# EAGLE design pcb9_21 (EAGLE 9.6.2)
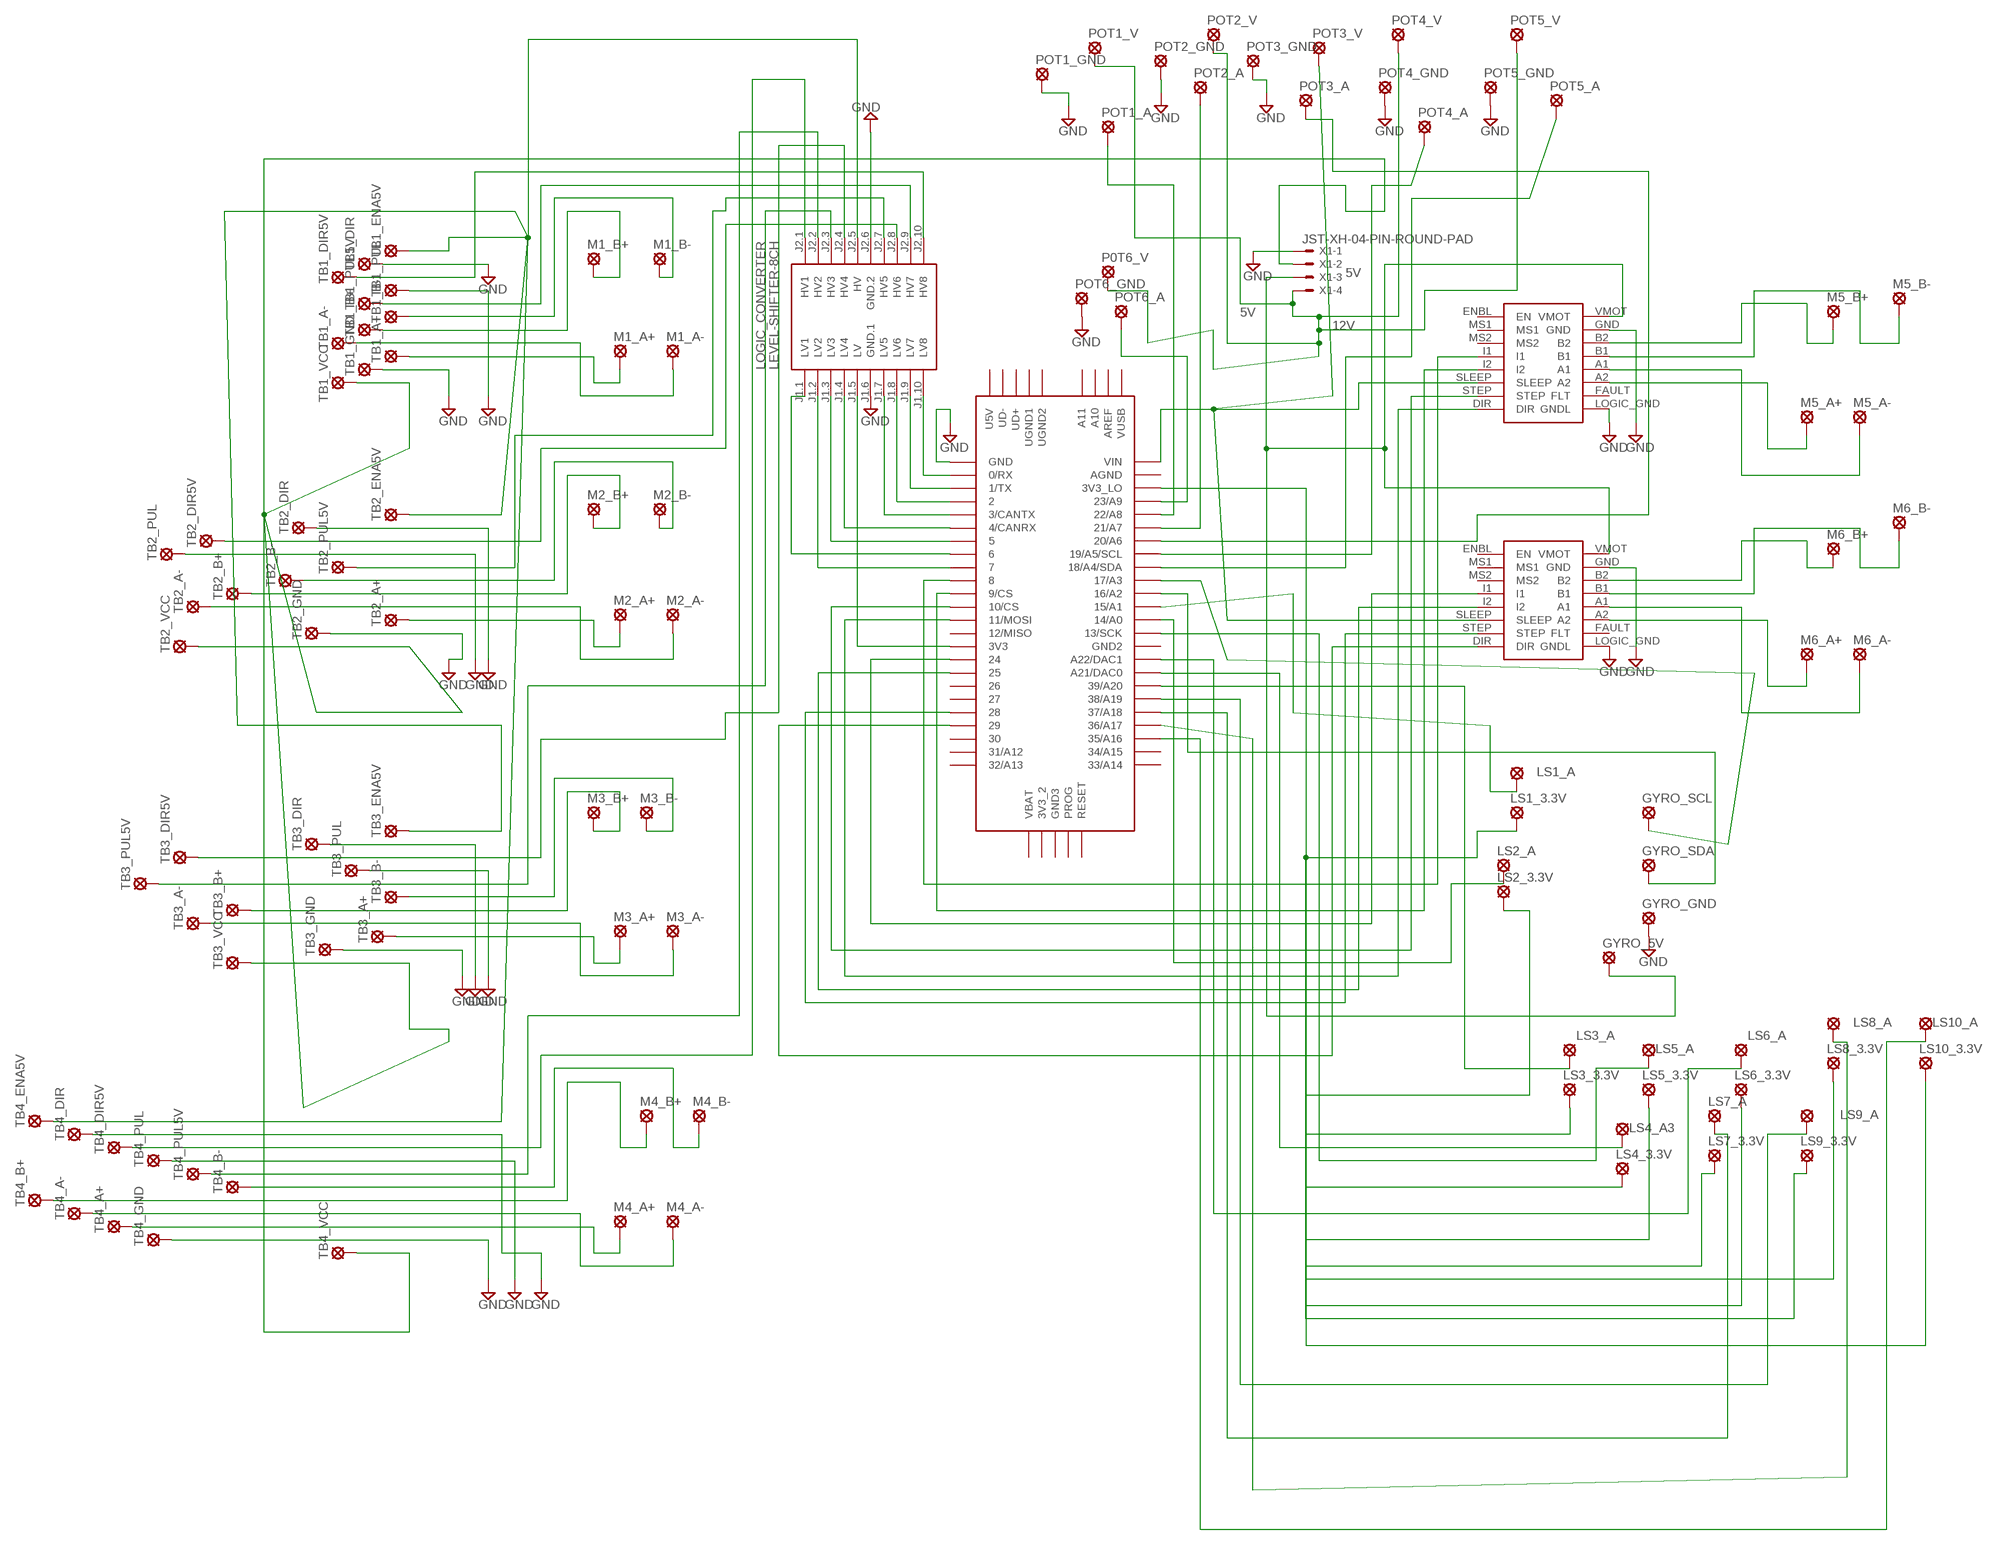
[diagram p0: schematic, sheet 1]

## Parts
GYRO_5V  LSP11  [LSP11]
GYRO_GND  LSP11  [LSP11]
GYRO_SCL  LSP11  [LSP11]
GYRO_SDA  LSP11  [LSP11]
LOGIC_CONVERTER  LEVEL-SHIFTER-8CH  [LEVEL-SHIFTER-8CH]
LS1_3.3V  LSP11  [LSP11]
LS1_A  LSP11  [LSP11]
LS2_3.3V  LSP11  [LSP11]
LS2_A  LSP11  [LSP11]
LS3_3.3V  LSP11  [LSP11]
LS3_A  LSP11  [LSP11]
LS4_3.3V  LSP11  [LSP11]
LS4_A3  LSP11  [LSP11]
LS5_3.3V  LSP11  [LSP11]
LS5_A  LSP11  [LSP11]
LS6_3.3V  LSP11  [LSP11]
LS6_A  LSP11  [LSP11]
LS7_3.3V  LSP11  [LSP11]
LS7_A  LSP11  [LSP11]
LS8_3.3V  LSP11  [LSP11]
LS8_A  LSP11  [LSP11]
LS9_3.3V  LSP11  [LSP11]
LS9_A  LSP11  [LSP11]
LS10_3.3V  LSP11  [LSP11]
LS10_A  LSP11  [LSP11]
M1_A+  LSP11  [LSP11]
M1_A-  LSP11  [LSP11]
M1_B+  LSP11  [LSP11]
M1_B-  LSP11  [LSP11]
M2_A+  LSP11  [LSP11]
M2_A-  LSP11  [LSP11]
M2_B+  LSP11  [LSP11]
M2_B-  LSP11  [LSP11]
M3_A+  LSP11  [LSP11]
M3_A-  LSP11  [LSP11]
M3_B+  LSP11  [LSP11]
M3_B-  LSP11  [LSP11]
M4_A+  LSP11  [LSP11]
M4_A-  LSP11  [LSP11]
M4_B+  LSP11  [LSP11]
M4_B-  LSP11  [LSP11]
M5_A+  LSP11  [LSP11]
M5_A-  LSP11  [LSP11]
M5_B+  LSP11  [LSP11]
M5_B-  LSP11  [LSP11]
M6_A+  LSP11  [LSP11]
M6_A-  LSP11  [LSP11]
M6_B+  LSP11  [LSP11]
M6_B-  LSP11  [LSP11]
MP6500_1  MP6500THROUGH_HOLE  [MP6500]
MP6500_2  MP6500THROUGH_HOLE  [MP6500]
P0T6_V  LSP11  [LSP11]
POT1_A  LSP11  [LSP11]
POT1_GND  LSP11  [LSP11]
POT1_V  LSP11  [LSP11]
POT2_A  LSP11  [LSP11]
POT2_GND  LSP11  [LSP11]
POT2_V  LSP11  [LSP11]
POT3_A  LSP11  [LSP11]
POT3_GND  LSP11  [LSP11]
POT3_V  LSP11  [LSP11]
POT4_A  LSP11  [LSP11]
POT4_GND  LSP11  [LSP11]
POT4_V  LSP11  [LSP11]
POT5_A  LSP11  [LSP11]
POT5_GND  LSP11  [LSP11]
POT5_V  LSP11  [LSP11]
POT6_A  LSP11  [LSP11]
POT6_GND  LSP11  [LSP11]
TB1_A+  LSP11  [LSP11]
TB1_A-  LSP11  [LSP11]
TB1_B+  LSP11  [LSP11]
TB1_B-  LSP11  [LSP11]
TB1_DIR  LSP11  [LSP11]
TB1_DIR5V  LSP11  [LSP11]
TB1_ENA5V  LSP11  [LSP11]
TB1_GND  LSP11  [LSP11]
TB1_PUL  LSP11  [LSP11]
TB1_PUL5V  LSP11  [LSP11]
TB1_VCC  LSP11  [LSP11]
TB2_A+  LSP11  [LSP11]
TB2_A-  LSP11  [LSP11]
TB2_B+  LSP11  [LSP11]
TB2_B-  LSP11  [LSP11]
TB2_DIR  LSP11  [LSP11]
TB2_DIR5V  LSP11  [LSP11]
TB2_ENA5V  LSP11  [LSP11]
TB2_GND  LSP11  [LSP11]
TB2_PUL  LSP11  [LSP11]
TB2_PUL5V  LSP11  [LSP11]
TB2_VCC  LSP11  [LSP11]
TB3_A+  LSP11  [LSP11]
TB3_A-  LSP11  [LSP11]
TB3_B+  LSP11  [LSP11]
TB3_B-  LSP11  [LSP11]
TB3_DIR  LSP11  [LSP11]
TB3_DIR5V  LSP11  [LSP11]
TB3_ENA5V  LSP11  [LSP11]
TB3_GND  LSP11  [LSP11]
TB3_PUL  LSP11  [LSP11]
TB3_PUL5V  LSP11  [LSP11]
TB3_VCC  LSP11  [LSP11]
TB4_A+  LSP11  [LSP11]
TB4_A-  LSP11  [LSP11]
TB4_B+  LSP11  [LSP11]
TB4_B-  LSP11  [LSP11]
TB4_DIR  LSP11  [LSP11]
TB4_DIR5V  LSP11  [LSP11]
TB4_ENA5V  LSP11  [LSP11]
TB4_GND  LSP11  [LSP11]
TB4_PUL  LSP11  [LSP11]
TB4_PUL5V  LSP11  [LSP11]
TB4_VCC  LSP11  [LSP11]
TEENSY4.1  TEENSY_3.5/3.6  [TEENSY_3.5/3.6]
X1  JST-XH-04-PIN-ROUND-PAD  [JST-XH-04-PACKAGE-ROUND-PAD]

## Nets
5V: GYRO_5V.MP MP6500_1.VMOT MP6500_2.VMOT TB1_VCC.MP TB2_VCC.MP TB3_VCC.MP TB4_VCC.MP X1.2 X1.3
12V: P0T6_V.MP POT1_V.MP POT2_V.MP POT4_V.MP POT5_V.MP X1.4
GND: GYRO_GND.MP LOGIC_CONVERTER.J1.6(GND.1) LOGIC_CONVERTER.J2.6(GND.2) MP6500_1.GND MP6500_1.LOGIC_GND(GNDL) MP6500_2.GND MP6500_2.LOGIC_GND(GNDL) POT1_GND.MP POT2_GND.MP POT3_GND.MP POT4_GND.MP POT5_GND.MP POT6_GND.MP TB1_DIR.MP TB1_GND.MP TB1_PUL.MP TB2_DIR.MP TB2_GND.MP TB2_PUL.MP TB3_DIR.MP TB3_GND.MP TB3_PUL.MP TB4_DIR.MP TB4_GND.MP TB4_PUL.MP TEENSY4.1.GND X1.1
N$1: M1_A+.MP TB1_A+.MP
N$2: M1_A-.MP TB1_A-.MP
N$3: M1_B+.MP TB1_B+.MP
N$4: M1_B-.MP TB1_B-.MP
N$5: M2_A+.MP TB2_A+.MP
N$6: M2_A-.MP TB2_A-.MP
N$7: M2_B+.MP TB2_B+.MP
N$8: M2_B-.MP TB2_B-.MP
N$9: M3_A+.MP TB3_A+.MP
N$10: M3_A-.MP TB3_A-.MP
N$11: M3_B+.MP TB3_B+.MP
N$12: M3_B-.MP TB3_B-.MP
N$13: M4_A+.MP TB4_A+.MP
N$14: M4_A-.MP TB4_A-.MP
N$15: M4_B+.MP TB4_B+.MP
N$16: M4_B-.MP TB4_B-.MP
N$17: LOGIC_CONVERTER.J2.9(HV7) TB1_PUL5V.MP
N$18: LOGIC_CONVERTER.J2.8(HV6) TB2_DIR5V.MP
N$19: LOGIC_CONVERTER.J1.7(LV5) TEENSY4.1.3/CANTX
N$20: LOGIC_CONVERTER.J2.10(HV8) TB1_DIR5V.MP
N$21: LOGIC_CONVERTER.J2.4(HV4) TB3_DIR5V.MP
N$22: LOGIC_CONVERTER.J1.4(LV4) TEENSY4.1.4/CANRX
N$23: LOGIC_CONVERTER.J1.1(LV1) TEENSY4.1.6
N$24: LOGIC_CONVERTER.J1.2(LV2) TEENSY4.1.7
N$25: M5_A+.MP MP6500_1.A2
N$26: M5_A-.MP MP6500_1.A1
N$27: POT6_A.MP TEENSY4.1.23/A9
N$28: M5_B-.MP MP6500_1.B1
N$29: M5_B+.MP MP6500_1.B2
N$30: M6_A+.MP MP6500_2.A2
N$31: M6_A-.MP MP6500_2.A1
N$32: M6_B-.MP MP6500_2.B1
N$33: M6_B+.MP MP6500_2.B2
N$34: MP6500_1.I1 TEENSY4.1.8
N$35: MP6500_1.I2 TEENSY4.1.9/CS
N$36: MP6500_1.STEP TEENSY4.1.10/CS
N$37: MP6500_1.DIR TEENSY4.1.11/MOSI
N$38: MP6500_2.I1 TEENSY4.1.24
N$39: MP6500_2.I2 TEENSY4.1.25
N$40: MP6500_2.STEP TEENSY4.1.28
N$41: MP6500_2.DIR TEENSY4.1.29
N$42: POT1_A.MP TEENSY4.1.22/A8
N$43: LOGIC_CONVERTER.J1.9(LV7) TEENSY4.1.1/TX
N$44: LOGIC_CONVERTER.J1.10(LV8) TEENSY4.1.0/RX
N$45: LOGIC_CONVERTER.J1.8(LV6) TEENSY4.1.2
N$46: LOGIC_CONVERTER.J2.3(HV3) TB3_PUL5V.MP
N$47: LOGIC_CONVERTER.J2.7(HV5) TB2_PUL5V.MP
N$48: LOGIC_CONVERTER.J1.3(LV3) TEENSY4.1.5
N$49: LOGIC_CONVERTER.J2.2(HV2) TB4_PUL5V.MP
N$50: LS5_A.MP TEENSY4.1.13/SCK
N$51: LOGIC_CONVERTER.J1.5(LV) TEENSY4.1.3V3
N$52: LOGIC_CONVERTER.J2.1(HV1) TB4_DIR5V.MP
N$53: POT2_A.MP TEENSY4.1.21/A7
N$54: POT3_A.MP TEENSY4.1.20/A6
N$55: POT4_A.MP TEENSY4.1.19/A5/SCL
N$56: MP6500_1.SLEEP MP6500_2.SLEEP POT3_V.MP TEENSY4.1.VIN
N$57: GYRO_SCL.MP TEENSY4.1.17/A3
N$58: GYRO_SDA.MP TEENSY4.1.16/A2
N$59: LS1_A.MP TEENSY4.1.15/A1
N$60: LS1_3.3V.MP LS2_3.3V.MP LS3_3.3V.MP LS4_3.3V.MP LS5_3.3V.MP LS6_3.3V.MP LS7_3.3V.MP LS8_3.3V.MP LS9_3.3V.MP LS10_3.3V.MP TEENSY4.1.3V3_LO
N$61: POT5_A.MP TEENSY4.1.18/A4/SDA
N$62: LOGIC_CONVERTER.J2.5(HV) TB1_ENA5V.MP TB2_ENA5V.MP TB3_ENA5V.MP TB4_ENA5V.MP
N$64: LS2_A.MP TEENSY4.1.14/A0
N$65: LS3_A.MP TEENSY4.1.39/A20
N$66: LS6_A.MP TEENSY4.1.A22/DAC1
N$67: LS4_A3.MP TEENSY4.1.21/DAC0(A21/DAC0)
N$68: LS9_A.MP TEENSY4.1.38/A19
N$69: LS7_A.MP TEENSY4.1.37/A18
N$70: LS8_A.MP TEENSY4.1.36/A17
N$71: LS10_A.MP TEENSY4.1.35/A16
Unconnected: MP6500_1.ENBL(EN) MP6500_1.FAULT(FLT) MP6500_1.MS1 MP6500_1.MS2 MP6500_2.ENBL(EN) MP6500_2.FAULT(FLT) MP6500_2.MS1 MP6500_2.MS2 TEENSY4.1.3V3_2 TEENSY4.1.12/MISO TEENSY4.1.26 TEENSY4.1.27 TEENSY4.1.30 TEENSY4.1.31/A12 TEENSY4.1.32/A13 TEENSY4.1.33/A14 TEENSY4.1.34/A15 TEENSY4.1.A10 TEENSY4.1.A11 TEENSY4.1.AGND TEENSY4.1.AREF TEENSY4.1.GND2 TEENSY4.1.GND3 TEENSY4.1.PROG TEENSY4.1.RESET TEENSY4.1.U5V TEENSY4.1.UD+ TEENSY4.1.UD- TEENSY4.1.UGND1 TEENSY4.1.UGND2 TEENSY4.1.VBAT TEENSY4.1.VUSB

## Library data of the parts
GYRO_5V GYRO_GND GYRO_SCL GYRO_SDA LS1_3.3V LS1_A LS2_3.3V LS2_A LS3_3.3V LS3_A LS4_3.3V LS4_A3 LS5_3.3V LS5_A LS6_3.3V LS6_A LS7_3.3V LS7_A LS8_3.3V LS8_A LS9_3.3V LS9_A LS10_3.3V LS10_A M1_A+ M1_A- M1_B+ M1_B- M2_A+ M2_A- M2_B+ M2_B- M3_A+ M3_A- M3_B+ M3_B- M4_A+ M4_A- M4_B+ M4_B- M5_A+ M5_A- M5_B+ M5_B- M6_A+ M6_A- M6_B+ M6_B- P0T6_V POT1_A POT1_GND POT1_V POT2_A POT2_GND POT2_V POT3_A POT3_GND POT3_V POT4_A POT4_GND POT4_V POT5_A POT5_GND POT5_V POT6_A POT6_GND TB1_A+ TB1_A- TB1_B+ TB1_B- TB1_DIR TB1_DIR5V TB1_ENA5V TB1_GND TB1_PUL TB1_PUL5V TB1_VCC TB2_A+ TB2_A- TB2_B+ TB2_B- TB2_DIR TB2_DIR5V TB2_ENA5V TB2_GND TB2_PUL TB2_PUL5V TB2_VCC TB3_A+ TB3_A- TB3_B+ TB3_B- TB3_DIR TB3_DIR5V TB3_ENA5V TB3_GND TB3_PUL TB3_PUL5V TB3_VCC TB4_A+ TB4_A- TB4_B+ TB4_B- TB4_DIR TB4_DIR5V TB4_ENA5V TB4_GND TB4_PUL TB4_PUL5V TB4_VCC = solpad:LSP11: SOLDER PAD drill 1.1 mm
LOGIC_CONVERTER = diy-modules:LEVEL-SHIFTER-8CH: 8-Channel Bi-Directional Logic Level Converter based on BSS128 transistors Click here to find device on ebay.com <http://www.ebay.com/sch/8+channel+level+converter> Note: There are many variants. Search for the proper version.
MP6500_1 MP6500_2 = MP6500:MP6500
TEENSY4.1 = Teensy356:TEENSY_3.5/3.6
X1 = Rembrandt Electronics - JST XH Connectors v1-0:JST-XH-04-PIN: JST XH Connector 2 Pin Wire to board connector. Pitch: 2,54 mm, (0.100") Number of pins: 4 Created by Rembrandt Electronics www.rembrandtelectronics.com

## Board
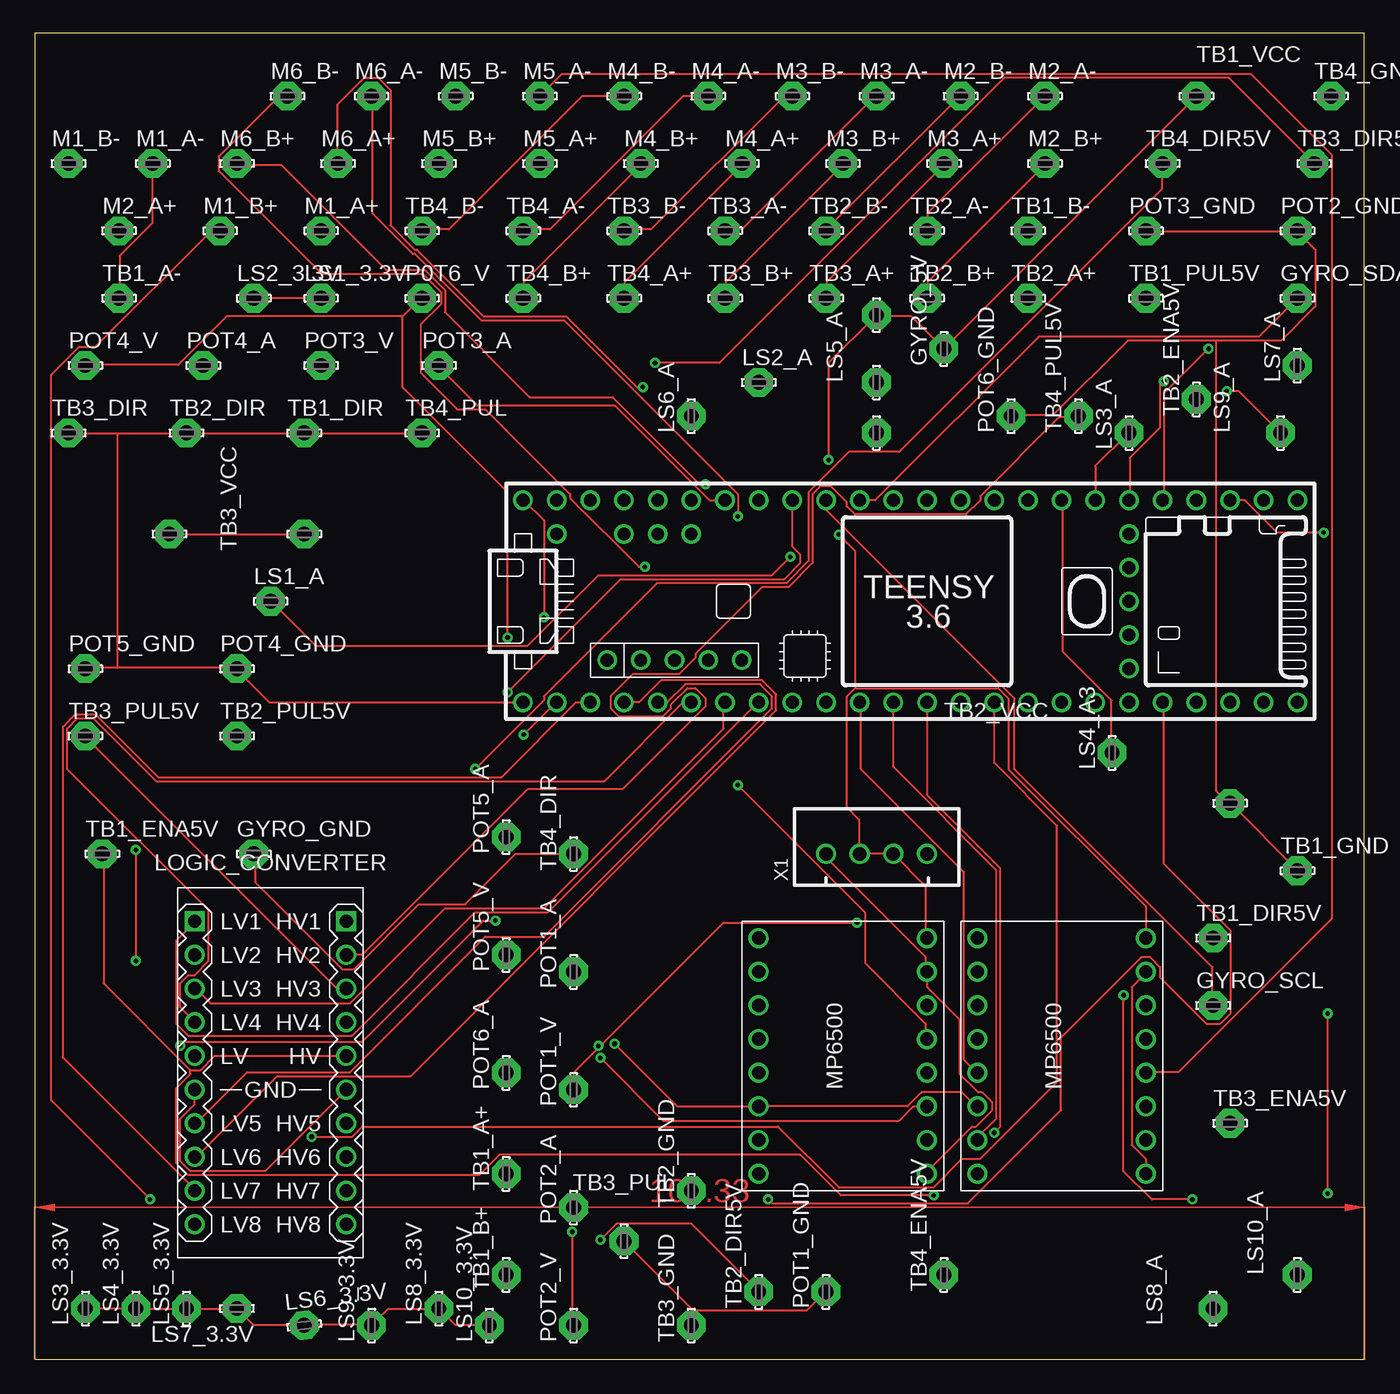
[diagram p1: board, top side]
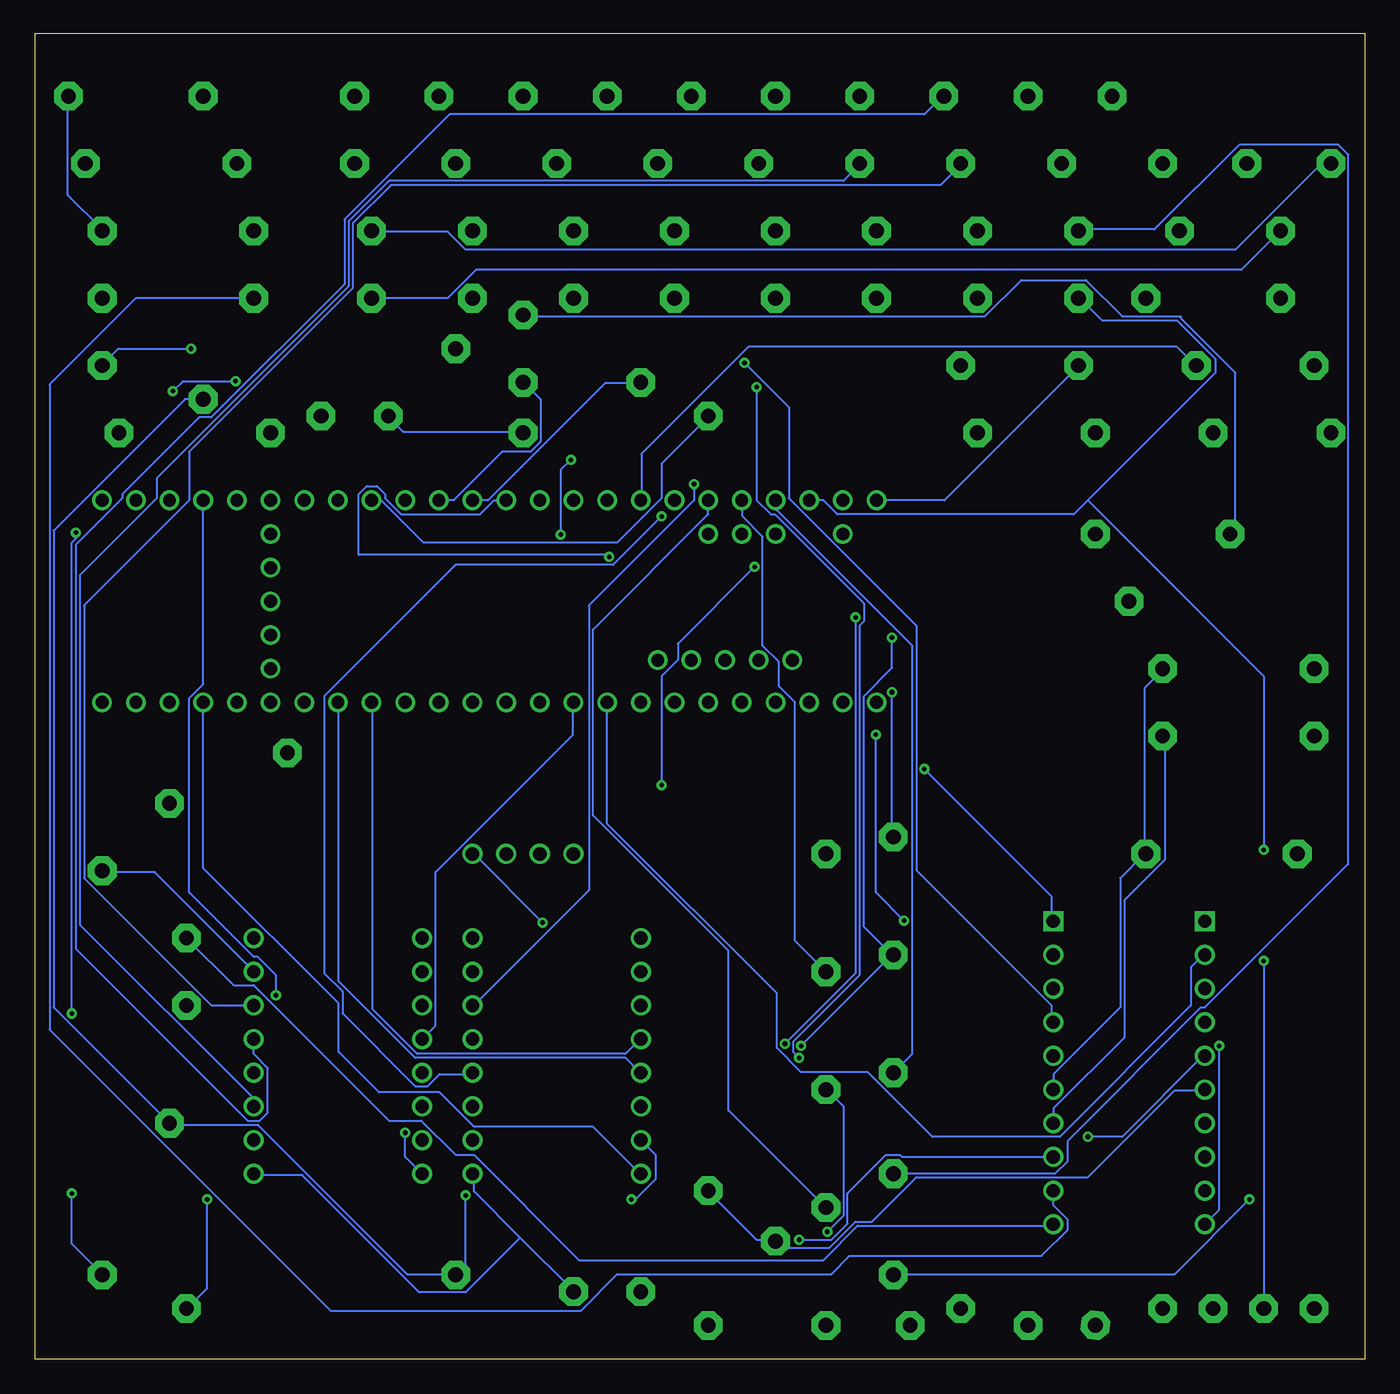
[diagram p2: board, bottom side, seen from below]

Size 100.31 x 100 mm. Coordinates in mm from the lower left corner, seen from the top.
Outline: 0,0 100.31,0 100.31,100 0,100 0,0
Copper layers (1*16): Top 0.035mm / dielectric 1.5mm / Bottom 0.035mm
Design rules "default": minimum track width 6mil, minimum drill 0.35mm, track to track 6mil, track to pad 6mil, pad to pad 6mil, via to via 6mil, smd to smd 6mil, copper to edge 40mil, drill to drill 6mil, minimum pad ring 10mil, minimum via ring 8mil, stop-mask expansion 4mil, vias tented up to drill 0mil, thermal gap 10mil

### Footprints (pad centres in the part's own frame; a part is rotated, then mirrored left to right if it is on the bottom)
LSP11 = drill 1.118 pad 2.159 octagon: MP 0,0
LEVEL-SHIFTER-8CH = drill 1 square: J1.1 -5.715,11.43; J2.1 5.715,11.43 | drill 1: J1.2 -5.715,8.89; J1.3 -5.715,6.35; J1.4 -5.715,3.81; J1.5 -5.715,1.27; J1.6 -5.715,-1.27; J1.7 -5.715,-3.81; J1.8 -5.715,-6.35; J1.9 -5.715,-8.89; J1.10 -5.715,-11.43; J2.2 5.715,8.89; J2.3 5.715,6.35; J2.4 5.715,3.81; J2.5 5.715,1.27; J2.6 5.715,-1.27; J2.7 5.715,-3.81; J2.8 5.715,-6.35; J2.9 5.715,-8.89; J2.10 5.715,-11.43
MP6500 = drill 1: A1 13.97,8.89; A2 13.97,6.35; B1 13.97,11.43; B2 13.97,13.97; DIR 1.27,1.27; ENBL 1.27,19.05; FAULT 13.97,3.81; GND 13.97,16.51; I1 1.27,11.43; I2 1.27,8.89; LOGIC_GND 13.97,1.27; MS1 1.27,16.51; MS2 1.27,13.97; SLEEP 1.27,6.35; STEP 1.27,3.81; VMOT 13.97,19.05
TEENSY_3.5/3.6 = drill 0.965: 0/RX -25.4,-7.62; 1/TX -22.86,-7.62; 2 -20.32,-7.62; 3/CANTX -17.78,-7.62; 3V3 7.62,-7.62; 3V3_2 17.78,-2.54; 3V3_LO -22.86,7.62; 4/CANRX -15.24,-7.62; 5 -12.7,-7.62; 6 -10.16,-7.62; 7 -7.62,-7.62; 8 -5.08,-7.62; 9/CS -2.54,-7.62; 10/CS 0,-7.62; 11/MOSI 2.54,-7.62; 12/MISO 5.08,-7.62; 13/SCK 5.08,7.62; 14/A0 2.54,7.62; 15/A1 0,7.62; 16/A2 -2.54,7.62; 17/A3 -5.08,7.62; 18/A4/SDA -7.62,7.62; 19/A5/SCL -10.16,7.62; 20/A6 -12.7,7.62; 21/A7 -15.24,7.62; 21/DAC0 12.7,7.62; 22/A8 -17.78,7.62; 23/A9 -20.32,7.62; 24 10.16,-7.62; 25 12.7,-7.62; 26 15.24,-7.62; 27 17.78,-7.62; 28 20.32,-7.62; 29 22.86,-7.62; 30 25.4,-7.62; 31/A12 27.94,-7.62; 32/A13 30.48,-7.62; 33/A14 30.48,7.62; 34/A15 27.94,7.62; 35/A16 25.4,7.62; 36/A17 22.86,7.62; 37/A18 20.32,7.62; 38/A19 17.78,7.62; 39/A20 15.24,7.62; A10 -17.78,5.08; A11 -15.24,5.08; A22/DAC1 10.16,7.62; AGND -25.4,7.62; AREF -20.32,5.08; GND -27.94,-7.62; GND2 7.62,7.62; GND3 17.78,0; PROG 17.78,2.54; RESET 17.78,5.08; U5V -21.59,-4.445; UD+ -16.51,-4.445; UD- -19.05,-4.445; UGND1 -13.97,-4.445; UGND2 -11.43,-4.445; VBAT 17.78,-5.08; VIN -27.94,7.62; VUSB -25.4,5.08
JST-XH-04-PACKAGE-ROUND-PAD = drill 1.016: 1 -3.81,0; 2 -1.27,0; 3 1.27,0; 4 3.81,0

### Placement (x,y rotation side)
GYRO_5V  68.58,76.2 90 top
GYRO_GND  16.51,38.1 0 top
GYRO_SCL  88.9,26.67 0 top
GYRO_SDA  95.25,80.01 0 top
LOGIC_CONVERTER  17.78,21.59 0 top
LS1_3.3V  21.59,80.01 0 top
LS1_A  17.78,57.15 0 top
LS2_3.3V  16.51,80.01 0 top
LS2_A  54.61,73.66 0 top
LS3_3.3V  3.81,3.81 90 top
LS3_A  82.55,69.85 90 top
LS4_3.3V  7.62,3.81 90 top
LS4_A3  81.28,45.72 90 top
LS5_3.3V  11.43,3.81 90 top
LS5_A  63.5,73.66 90 top
LS6_3.3V  20.32,2.54 6.6 top
LS6_A  49.53,71.12 90 top
LS7_3.3V  15.24,3.81 180 top
LS7_A  95.25,74.93 90 top
LS8_3.3V  30.48,3.81 90 top
LS8_A  88.9,3.81 90 top
LS9_3.3V  25.4,2.54 90 top
LS9_A  93.98,69.85 90 top
LS10_3.3V  34.29,2.54 90 top
LS10_A  95.25,6.35 90 top
M1_A+  21.59,85.09 0 top
M1_A-  8.89,90.17 0 top
M1_B+  13.97,85.09 0 top
M1_B-  2.54,90.17 0 top
M2_A+  6.35,85.09 0 top
M2_A-  76.2,95.25 0 top
M2_B+  76.2,90.17 0 top
M2_B-  69.85,95.25 0 top
M3_A+  68.58,90.17 0 top
M3_A-  63.5,95.25 0 top
M3_B+  60.96,90.17 0 top
M3_B-  57.15,95.25 0 top
M4_A+  53.34,90.17 0 top
M4_A-  50.8,95.25 0 top
M4_B+  45.72,90.17 0 top
M4_B-  44.45,95.25 0 top
M5_A+  38.1,90.17 0 top
M5_A-  38.1,95.25 0 top
M5_B+  30.48,90.17 0 top
M5_B-  31.75,95.25 0 top
M6_A+  22.86,90.17 0 top
M6_A-  25.4,95.25 0 top
M6_B+  15.24,90.17 0 top
M6_B-  19.05,95.25 0 top
MP6500_1  69.85,12.7 0 top
MP6500_2  53.34,12.7 0 top
P0T6_V  29.21,80.01 0 top
POT1_A  40.64,29.21 90 top
POT1_GND  59.69,5.08 90 top
POT1_V  40.64,20.32 90 top
POT2_A  40.64,11.43 90 top
POT2_GND  95.25,85.09 0 top
POT2_V  40.64,2.54 90 top
POT3_A  30.48,74.93 0 top
POT3_GND  83.82,85.09 0 top
POT3_V  21.59,74.93 0 top
POT4_A  12.7,74.93 0 top
POT4_GND  15.24,52.07 0 top
POT4_V  3.81,74.93 0 top
POT5_A  35.56,39.37 90 top
POT5_GND  3.81,52.07 0 top
POT5_V  35.56,30.48 90 top
POT6_A  35.56,21.59 90 top
POT6_GND  73.66,71.12 90 top
TB1_A+  35.56,13.97 90 top
TB1_A-  6.35,80.01 0 top
TB1_B+  35.56,6.35 90 top
TB1_B-  74.93,85.09 0 top
TB1_DIR  20.32,69.85 0 top
TB1_DIR5V  88.9,31.75 0 top
TB1_ENA5V  5.08,38.1 0 top
TB1_GND  95.25,36.83 0 top
TB1_PUL  63.5,69.85 90 top
TB1_PUL5V  83.82,80.01 0 top
TB1_VCC  87.63,95.25 0 top
TB2_A+  74.93,80.01 0 top
TB2_A-  67.31,85.09 0 top
TB2_B+  67.31,80.01 0 top
TB2_B-  59.69,85.09 0 top
TB2_DIR  11.43,69.85 0 top
TB2_DIR5V  54.61,5.08 90 top
TB2_ENA5V  87.63,72.39 90 top
TB2_GND  49.53,12.7 90 top
TB2_PUL  90.17,41.91 0 top
TB2_PUL5V  15.24,46.99 0 top
TB2_VCC  20.32,62.23 0 top
TB3_A+  59.69,80.01 0 top
TB3_A-  52.07,85.09 0 top
TB3_B+  52.07,80.01 0 top
TB3_B-  44.45,85.09 0 top
TB3_DIR  2.54,69.85 0 top
TB3_DIR5V  96.52,90.17 0 top
TB3_ENA5V  90.17,17.78 0 top
TB3_GND  49.53,2.54 90 top
TB3_PUL  44.45,8.89 90 top
TB3_PUL5V  3.81,46.99 0 top
TB3_VCC  10.16,62.23 0 top
TB4_A+  44.45,80.01 0 top
TB4_A-  36.83,85.09 0 top
TB4_B+  36.83,80.01 0 top
TB4_B-  29.21,85.09 0 top
TB4_DIR  40.64,38.1 90 top
TB4_DIR5V  85.09,90.17 0 top
TB4_ENA5V  68.58,6.35 90 top
TB4_GND  97.79,95.25 0 top
TB4_PUL  29.21,69.85 0 top
TB4_PUL5V  78.74,71.12 90 top
TB4_VCC  63.5,78.74 90 top
TEENSY4.1  64.77,57.15 0 top
X1  63.5,38.1 0 top

### Tracks (layer width: path | path; a pad name or v marks a point on that pad's centre or on a via)
5V  (via drill 0.35)
  Top 0.152: 61.87,50.6 72.69,50.6 73.46,49.84 73.46,44.5 83.82,34.14 MP6500_1.VMOT | 61.87,50.6 61.27,49.99 61.27,41.6 62.18,40.69 62.18,38.1 X1.2 X1.3 67.21,35.66 67.21,31.85 MP6500_2.VMOT | TB2_VCC.MP 20.27,62.18 10.21,62.18 TB3_VCC.MP | 61.87,50.6 61.87,60.96 v60.66,62.18 | v59.89,67.82 59.89,75.13 TB4_VCC.MP 63.55,78.64 66.14,78.64 GYRO_5V.MP TB1_VCC.MP
  Bottom 0.152: TB4_VCC.MP 63.4,78.64 28.65,78.64 25.91,81.38 21.03,81.38 18.29,78.64 13.87,78.64 13.87,78.49 9.75,74.37 9.75,62.64 TB3_VCC.MP | v60.66,62.18 60.66,67.06 v59.89,67.82
12V  (via drill 0.35)
  Top 0.152: 27.74,78.64 14.48,78.64 10.82,74.98 3.81,74.98 POT4_V.MP | 27.74,78.64 29.11,80.01 P0T6_V.MP | v62.03,32.92 51.97,32.92 42.67,23.62 | 42.67,23.62 40.69,21.64 40.69,20.42 POT1_V.MP | v40.54,9.6 40.54,2.59 POT2_V.MP | 42.67,23.62 v42.52,23.62 | 27.74,78.64 27.74,73.3 35.66,65.38 v35.66,54.41
  Bottom 0.152: v62.03,32.92 67.21,38.1 X1.4 | v40.54,9.6 39.32,10.82 39.32,19.05 40.54,20.27 POT1_V.MP | v42.52,23.62 35.66,30.48 | v35.66,54.41 35.66,52.12 37.8,49.99 37.8,32.61 35.66,30.48 | 35.66,30.48 POT5_V.MP
GND
  Top 0.152: 11.43,69.8 6.25,69.8 | 6.25,69.8 2.59,69.8 TB3_DIR.MP | TB4_PUL.MP 29.11,69.8 20.42,69.8 TB1_DIR.MP 20.27,69.8 11.43,69.8 | 11.43,69.8 TB2_DIR.MP | LOGIC_CONVERTER.J1.6 12.04,20.27 12.04,19.2 10.97,18.14 10.97,14.94 11.73,14.17 17.37,14.17 23.47,20.27 LOGIC_CONVERTER.J2.6 | TEENSY4.1.GND 17.68,49.53 15.24,51.97 POT4_GND.MP 15.24,52.12 6.25,52.12 | TB4_DIR.MP 36.27,38.1 32.46,34.29 28.96,34.29 24.08,29.41 23.16,29.41 16.61,35.97 16.61,38.1 GYRO_GND.MP | 6.25,52.12 3.81,52.12 POT5_GND.MP | 6.25,52.12 6.25,69.8 | 95.25,85.04 83.82,85.04 POT3_GND.MP | 89.15,76.81 94.03,76.81 96.62,79.4 96.62,83.67 95.25,85.04 | 89.15,76.81 82.45,76.81 76.81,71.17 73.76,71.17 POT6_GND.MP | 95.25,85.04 POT2_GND.MP | TB1_GND.MP 95.25,36.88 90.22,41.91 TB2_PUL.MP 90.07,41.91 89.15,42.82 89.15,76.81 | MP6500_1.LOGIC_GND 83.82,15.09 82.75,16.15 82.75,28.04 83.82,29.11 MP6500_1.GND | 49.53,3.66 49.53,3.81 TB3_PUL.MP | 49.53,3.66 TB3_GND.MP | X1.1 59.74,38.1 59.74,37.8 67.21,30.33 67.21,29.26 MP6500_2.GND 67.36,29.11 67.36,28.04 69.8,25.6 69.8,21.49 71.17,20.12 71.48,20.12 72.24,19.36 72.24,18.75 71.02,17.53 70.71,17.53 67.21,14.02 MP6500_2.LOGIC_GND | 49.53,3.66 58.22,3.66 59.59,5.03 POT1_GND.MP
  Bottom 0.152: 16.61,38.1 16.61,50.6 15.24,51.97 POT4_GND.MP | 16.61,38.1 18.44,36.27 18.44,26.52 23.47,21.49 23.47,20.42 LOGIC_CONVERTER.J2.6 | 16.61,38.1 GYRO_GND.MP | TB1_PUL.MP 63.55,69.95 72.54,69.95 73.61,71.02 POT6_GND.MP | TB4_GND.MP 97.84,95.25 97.84,87.78 95.25,85.19 POT2_GND.MP | TB1_GND.MP 95.25,36.73 91.29,36.73 83.82,29.26 MP6500_1.GND | TB2_GND.MP 49.53,12.65 45.87,8.99 44.5,8.99 TB3_PUL.MP 44.35,8.84 43.89,8.38 40.39,8.38 38.41,10.36 37.19,10.36 33.83,13.72 20.88,13.72 14.33,20.27 12.19,20.27 LOGIC_CONVERTER.J1.6 | 63.7,9.14 59.74,5.18 POT1_GND.MP | 63.7,9.14 67.21,12.65 67.21,13.87 MP6500_2.LOGIC_GND | 63.7,9.14 67.82,5.03 71.32,5.03 80.16,13.87 83.82,13.87 MP6500_1.LOGIC_GND
N$1
  Bottom 0.152: M1_A+.MP 21.49,85.19 15.85,85.19 9.45,91.59 1.98,91.59 1.22,90.83 1.22,37.34 12.04,26.52 12.34,26.52 22.4,16.46 22.4,14.94 23.32,14.02 35.51,14.02 TB1_A+.MP
N$2
  Top 0.152: TB1_A-.MP 6.4,80.01 6.4,83.21 8.84,85.65 8.84,90.07 M1_A-.MP
N$3  (via drill 0.35)
  Top 0.152: v8.69,12.04 1.22,19.51 1.22,74.22 3.35,76.35 4.57,76.35 13.26,85.04 13.87,85.04 M1_B+.MP
  Bottom 0.152: v8.69,12.04 14.33,6.4 35.51,6.4 TB1_B+.MP
N$4
  Bottom 0.152: TB1_B-.MP 74.83,85.04 69.19,85.04 67.82,83.67 9.75,83.67 3.35,90.07 2.59,90.07 M1_B-.MP
N$5
  Bottom 0.152: TB2_A+.MP 69.19,80.01 67.06,82.14 9.3,82.14 M2_A+.MP
N$6
  Top 0.152: M2_A-.MP 67.36,86.41 67.36,85.19 TB2_A-.MP
N$7
  Top 0.152: TB2_B+.MP 67.36,80.01 67.36,81.23 76.2,90.07 M2_B+.MP
N$8
  Top 0.152: TB2_B-.MP 59.74,85.19 69.8,95.25 M2_B-.MP
N$9
  Top 0.152: TB3_A+.MP 59.74,80.01 59.74,81.23 68.58,90.07 M3_A+.MP
N$10
  Top 0.152: TB3_A-.MP 52.12,85.19 53.34,85.19 63.4,95.25 M3_A-.MP
N$11
  Top 0.152: TB3_B+.MP 52.12,80.01 52.12,81.23 60.96,90.07 M3_B+.MP
N$12
  Top 0.152: M3_B-.MP 56.54,95.25 46.48,85.19 44.5,85.19 TB3_B-.MP
N$13
  Top 0.152: TB4_A+.MP 44.5,80.01 44.5,81.23 53.34,90.07 M4_A+.MP
N$14
  Top 0.152: M4_A-.MP 48.92,95.25 38.86,85.19 36.88,85.19 TB4_A-.MP
N$15
  Top 0.152: TB4_B+.MP 36.88,80.01 36.88,81.23 45.72,90.07 M4_B+.MP
N$16
  Top 0.152: M4_B-.MP 41.3,95.25 31.24,85.19 29.26,85.19 TB4_B-.MP
N$17
  Bottom 0.152: TB1_PUL5V.MP 92.71,80.01 99.21,73.51 99.21,24.84 78.03,3.66 59.13,3.66 56.39,6.4 40.23,6.4 38.86,7.77 24.38,7.77 22.4,9.75 22.4,10.52 23.47,11.58 23.47,12.65 LOGIC_CONVERTER.J2.9
N$18  (via drill 0.35)
  Top 0.152: v42.67,8.99 43.89,10.21 49.53,10.21 54.56,5.18 TB2_DIR5V.MP
  Bottom 0.152: LOGIC_CONVERTER.J2.8 34.9,15.24 35.05,15.39 36.12,15.39 39.01,12.5 39.01,10.21 40.23,8.99 v42.67,8.99
N$19
  Top 0.152: TEENSY4.1.3/CANTX 47.7,49.53 49.07,50.9 54.71,50.9 55.63,49.99 55.63,49.07 38.41,31.85 33.98,31.85 23.77,21.64 16,21.64 12.19,17.83 LOGIC_CONVERTER.J1.7
N$20
  Bottom 0.152: TB1_DIR5V.MP 85.34,28.19 83.82,28.19 73.61,17.98 71.17,17.98 68.58,15.39 67.21,15.39 59.28,7.47 40.84,7.47 38.25,10.06 23.62,10.06 LOGIC_CONVERTER.J2.10
N$21  (via drill 0.35)
  Top 0.152: v46.79,75.13 51.66,75.13 73.15,96.62 90.07,96.62 TB3_DIR5V.MP
  Bottom 0.152: v46.79,75.13 43.43,71.78 43.43,64.92 33.83,55.32 33.83,36.88 23.62,26.67 23.62,25.45 LOGIC_CONVERTER.J2.4
N$22
  Top 0.152: TEENSY4.1.4/CANRX 48.92,49.53 42.98,43.59 9.14,43.59 4.42,48.31 3.2,48.31 2.44,47.55 2.44,44.5 13.11,33.83 13.11,30.02 12.04,28.96 11.58,28.96 10.97,28.35 10.97,26.52 12.04,25.45 LOGIC_CONVERTER.J1.4
N$23
  Top 0.152: TEENSY4.1.6 54.56,49.53 38.71,33.68 33.22,33.68 23.93,24.38 11.58,24.38 10.67,25.3 10.67,31.55 12.04,32.92 LOGIC_CONVERTER.J1.1
N$24
  Bottom 0.152: TEENSY4.1.7 57.15,40.39 44.35,27.58 44.35,23.47 42.52,21.64 37.49,21.64 32.61,16.76 23.01,16.76 13.11,26.67 13.11,29.57 12.19,30.48 LOGIC_CONVERTER.J1.2
N$25
  Bottom 0.152: MP6500_1.A2 83.82,19.66 96.93,32.77 96.93,59.13 91.14,64.92 91.14,66.45 76.66,80.92 76.66,85.8 73.61,88.85 39.32,88.85 38.1,90.07 M5_A+.MP
N$26
  Top 0.152: M5_A-.MP 39.78,96.93 91.75,96.93 97.84,90.83 97.84,33.22 86.26,21.64 83.82,21.64 MP6500_1.A1
N$27
  Bottom 0.152: POT6_A.MP 34.14,23.01 34.14,53.8 44.35,64.01 44.35,64.77 TEENSY4.1.23/A9
N$28
  Bottom 0.152: MP6500_1.B1 83.82,23.01 82.75,21.95 82.75,18.59 83.36,17.98 84.28,17.98 97.23,30.94 97.23,61.42 93.73,64.92 93.73,65.23 87.94,71.02 87.02,71.02 76.96,81.08 76.96,85.95 69.04,93.88 33.22,93.88 31.85,95.25 M5_B-.MP
N$29
  Bottom 0.152: MP6500_1.B2 87.02,26.67 96.62,36.27 96.62,56.84 88.7,64.77 88.7,68.43 76.35,80.77 76.35,85.65 73.46,88.54 32,88.54 30.48,90.07 M5_B+.MP
N$30  (via drill 0.35)
  Top 0.152: MP6500_2.A2 66.29,19.05 65.23,17.98 47.4,17.98 v42.67,22.71 | v45.87,73.3 45.41,73.3 40.08,78.64 33.83,78.64 28.8,83.67 28.65,83.67 26.82,85.5 26.82,95.71 25.91,96.62 24.84,96.62 22.86,94.64 M6_A+.MP
  Bottom 0.152: v42.67,22.71 43.13,23.16 43.13,23.93 38.1,28.96 38.1,55.32 37.8,55.63 37.8,57 44.5,63.7 44.81,63.7 45.87,64.77 v45.87,73.3
N$31  (via drill 0.35)
  Top 0.152: v53.03,63.55 53.03,65.23 39.93,78.33 33.68,78.33 28.65,83.36 28.5,83.36 25.45,86.41 25.45,95.25 M6_A-.MP
  Bottom 0.152: v53.03,63.55 56.69,59.89 68.58,59.89 78.49,49.99 78.49,29.11 77.11,27.74 77.11,26.06 71.63,20.57 70.71,20.57 69.8,21.49 67.36,21.49 MP6500_2.A1
N$32  (via drill 0.35)
  Top 0.152: v53.03,43.28 62.64,33.68 62.64,29.87 67.21,25.3 67.21,24.23 MP6500_2.B1 | v46.02,59.74 45.57,59.74 40.39,64.92 40.39,65.23 33.98,71.63 31.85,71.63 29.11,74.37 29.11,78.03 30.63,79.55 30.63,80.47 29.26,81.84 21.64,81.84 13.87,89.61 13.87,90.68 18.44,95.25 M6_B-.MP
  Bottom 0.152: v53.03,43.28 53.03,51.51 51.82,52.73 51.82,53.95 v46.02,59.74
N$33  (via drill 0.35)
  Top 0.152: v50.6,65.99 50.14,65.99 43.59,72.54 37.34,72.54 30.94,78.94 30.94,80.62 29.41,82.14 26.52,82.14 18.59,90.07 15.24,90.07 M6_B+.MP
  Bottom 0.152: v50.6,65.99 50.6,64.77 58.52,56.84 58.52,35.36 67.21,26.67 MP6500_2.B2
N$34
  Bottom 0.152: MP6500_1.I1 70.1,25.15 70.1,36.73 59.74,47.09 59.74,49.53 TEENSY4.1.8
N$35
  Top 0.152: TEENSY4.1.9/CS 62.33,49.53 62.33,44.5 70.1,36.73 70.1,22.55 71.02,21.64 MP6500_1.I2
N$36
  Top 0.152: TEENSY4.1.10/CS 64.77,44.65 72.54,36.88 72.54,18.14 71.02,16.61 MP6500_1.STEP
N$37  (via drill 0.35)
  Top 0.152: v72.39,17.07 72.85,17.53 72.85,37.03 67.36,42.52 67.36,49.53 TEENSY4.1.11/MOSI
  Bottom 0.152: v72.39,17.07 72.39,15.24 MP6500_1.DIR
N$38
  Bottom 0.152: TEENSY4.1.24 74.83,49.53 74.83,26.36 71.48,23.01 55.78,23.01 54.71,24.08 MP6500_2.I1
N$39
  Bottom 0.152: TEENSY4.1.25 77.42,49.53 77.42,28.5 71.63,22.71 55.78,22.71 54.71,21.64 MP6500_2.I2
N$40  (via drill 0.35)
  Top 0.152: v55.32,12.04 55.63,11.73 70.41,11.73 77.42,18.75 77.42,24.23 83.52,30.33 84.12,30.33 84.89,29.57 84.89,28.8 88.39,25.3 89.46,25.3 90.22,26.06 90.22,32.31 85.19,37.34 85.19,49.53 TEENSY4.1.28
  Bottom 0.152: v55.32,12.04 55.02,12.04 53.49,13.56 53.49,15.39 MP6500_2.STEP
N$41
  Bottom 0.152: TEENSY4.1.29 87.63,37.03 77.42,26.82 77.42,23.16 74.37,20.12 69.8,20.12 67.21,17.53 58.22,17.53 54.71,14.02 MP6500_2.DIR
N$42
  Bottom 0.152: POT1_A.MP 42.98,31.55 42.98,49.53 44.2,50.75 44.2,52.58 45.41,53.8 45.41,62.03 46.94,63.55 46.94,64.77 TEENSY4.1.22/A8
N$43
  Top 0.152: TEENSY4.1.1/TX 40.84,49.53 35.2,43.89 9.3,43.89 4.57,48.62 3.05,48.62 2.13,47.7 2.13,22.71 12.04,12.8 LOGIC_CONVERTER.J1.9
N$44  (via drill 0.35)
  Top 0.152: v36.88,47.09 39.32,49.53 TEENSY4.1.0/RX | v34.75,33.07 33.83,33.07 24.69,23.93 11.28,23.93 v10.97,23.62
  Bottom 0.152: v36.88,47.09 36.88,35.2 v34.75,33.07 | v10.97,23.62 10.97,11.28 12.04,10.21 LOGIC_CONVERTER.J1.10
N$45
  Top 0.152: TEENSY4.1.2 45.57,49.53 47.24,51.21 54.86,51.21 55.93,50.14 55.93,48.92 28.35,21.34 18.29,21.34 12.19,15.24 LOGIC_CONVERTER.J1.8
N$46
  Top 0.152: LOGIC_CONVERTER.J2.3 23.47,28.04 22.71,28.04 3.81,46.94 TB3_PUL5V.MP
N$47
  Bottom 0.152: LOGIC_CONVERTER.J2.7 23.47,17.83 23.47,18.9 18.14,24.23 18.14,34.59 15.09,37.64 15.09,46.79 15.24,46.94 TB2_PUL5V.MP
N$48
  Top 0.152: TEENSY4.1.5 51.97,49.53 51.97,47.55 38.41,33.98 30.94,33.98 23.77,26.82 13.26,26.82 12.19,27.89 LOGIC_CONVERTER.J1.3
N$49
  Top 0.152: LOGIC_CONVERTER.J2.2 24.69,30.48 37.19,42.98 44.35,42.98 50.6,49.23 50.6,49.84 49.84,50.6 49.23,50.6 48.01,49.38 48.01,49.07 47.4,48.46 44.04,48.46 43.43,49.07 43.43,49.99 45.11,51.66 48.62,51.66 49.84,52.88 49.84,53.19 54.86,58.22 56.84,58.22 58.67,60.05 58.67,65.23 59.28,65.84 60.05,65.84 61.27,64.62 61.27,64.31 61.87,63.7 70.26,63.7 71.32,64.77 71.32,65.08 77.27,71.02 78.64,71.02 TB4_PUL5V.MP
N$50
  Bottom 0.152: TEENSY4.1.13/SCK 68.73,64.77 65.08,68.43 62.94,68.43 62.18,69.19 62.18,72.39 63.4,73.61 LS5_A.MP
N$51  (via drill 0.35)
  Top 0.152: TEENSY4.1.3V3 72.39,44.96 77.11,40.23 77.11,20.88 71.32,15.09 69.95,15.09 67.82,12.95 60.66,12.95 56.08,17.53 24.69,17.53 23.93,16.76 v20.88,16.76
  Bottom 0.152: v20.88,16.76 18.29,16.76 12.19,22.86 LOGIC_CONVERTER.J1.5
N$52  (via drill 0.35)
  Top 0.152: v33.22,44.5 38.41,49.68 38.41,49.99 46.94,58.52 56.69,58.52 58.37,60.2 58.37,65.38 61.42,68.43 65.23,68.43 85.04,88.24 85.04,90.07 TB4_DIR5V.MP
  Bottom 0.152: v33.22,44.5 23.62,34.9 23.62,33.07 LOGIC_CONVERTER.J2.1
N$53
  Bottom 0.152: TEENSY4.1.21/A7 49.53,63.7 58.22,55.02 58.22,41 48.01,30.79 48.01,18.75 40.69,11.43 POT2_A.MP
N$54
  Top 0.152: TEENSY4.1.20/A6 50.9,64.77 43.74,71.93 33.38,71.93 30.48,74.83 POT3_A.MP
N$55
  Bottom 0.152: TEENSY4.1.19/A5/SCL 54.56,64.77 54.56,68.28 46.48,76.35 14.17,76.35 12.8,74.98 POT4_A.MP
N$56  (via drill 0.35)
  Top 0.152: MP6500_1.SLEEP 71.02,19.05 69.95,20.12 66.9,20.12 65.84,19.05 MP6500_2.SLEEP 48.46,19.05 v43.74,23.77 | v38.41,55.93 38.41,63.25 36.88,64.77 TEENSY4.1.VIN
  Bottom 0.152: TEENSY4.1.VIN 31.7,64.77 21.64,74.83 POT3_V.MP | v43.74,23.77 38.41,29.11 v38.41,55.93
N$57
  Top 0.152: TEENSY4.1.17/A3 59.74,64.77 59.74,64.01 73.91,49.84 73.91,44.5 88.85,29.57 88.85,26.67 GYRO_SCL.MP
N$58
  Top 0.152: TEENSY4.1.16/A2 63.4,64.77 75.74,77.11 92.35,77.11 GYRO_SDA.MP
N$59  (via drill 0.35)
  Top 0.152: v57,60.5 55.63,59.13 42.52,59.13 37.19,53.8 21.18,53.8 17.83,57.15 LS1_A.MP
  Bottom 0.152: v57,60.5 57.15,60.66 75.89,60.66 75.89,65.23 75.29,65.84 74.52,65.84 73.91,65.23 73.91,64.92 72.69,63.7 66.75,63.7 65.68,64.77 TEENSY4.1.15/A1
N$60  (via drill 0.35)
  Top 0.152: LS10_3.3V.MP 34.29,2.59 31.7,2.59 LS8_3.3V.MP 26.67,3.81 LS9_3.3V.MP 25.3,2.59 20.42,2.59 LS6_3.3V.MP 20.27,2.59 16.46,2.59 LS7_3.3V.MP LS5_3.3V.MP LS4_3.3V.MP LS3_3.3V.MP | LS1_3.3V.MP LS2_3.3V.MP | v7.62,38.41 v7.62,30.02
  Bottom 0.152: TEENSY4.1.3V3_LO 40.84,64.77 39.78,63.7 21.95,63.7 20.88,64.77 | 20.88,64.77 11.28,74.37 11.28,75.44 14.17,78.33 19.81,78.33 21.49,80.01 LS1_3.3V.MP | v7.62,30.02 LS4_3.3V.MP | v7.62,38.41 7.62,51.51 20.88,64.77
N$61  (via drill 0.35)
  Top 0.152: TEENSY4.1.18/A4/SDA 57.15,61.27 57.76,60.66 57.76,60.05 56.54,58.83 44.2,58.83 v35.66,50.29
  Bottom 0.152: v35.66,50.29 35.66,39.47 POT5_A.MP
N$62  (via drill 0.35)
  Top 0.152: LOGIC_CONVERTER.J2.5 13.56,22.86 12.5,21.79 11.73,21.79 | 11.73,21.79 5.18,28.35 5.18,38.1 TB1_ENA5V.MP | 11.73,21.79 11.73,21.49 10.67,20.42 10.67,14.78 11.58,13.87 33.53,13.87 35.05,15.39 57.76,15.39 60.81,12.34 v67.82,12.34
  Bottom 0.152: 68.58,6.4 72.24,6.4 83.52,17.68 90.07,17.68 TB3_ENA5V.MP 98.91,26.52 98.91,62.48 89,72.39 88.44,72.39 TB2_ENA5V.MP | v67.82,12.34 67.82,7.16 68.58,6.4 | 68.58,6.4 TB4_ENA5V.MP
N$64
  Bottom 0.152: TEENSY4.1.14/A0 66.14,64.77 57.3,73.61 54.71,73.61 LS2_A.MP
N$65
  Top 0.152: TEENSY4.1.39/A20 80.01,67.36 82.45,69.8 LS3_A.MP
N$66
  Bottom 0.152: TEENSY4.1.A22/DAC1 74.22,64.77 71.02,61.57 56.39,61.57 53.03,64.92 53.03,67.51 49.53,71.02 LS6_A.MP
N$67
  Top 0.152: TEENSY4.1.21/DAC0 77.57,64.77 77.57,53.34 81.23,49.68 81.23,45.72 LS4_A3.MP
N$68  (via drill 0.35)
  Top 0.152: v85.19,73.76 84.89,73.46 84.89,70.26 82.6,67.97 82.6,64.77 TEENSY4.1.38/A19 | v89.92,73 90.83,73 LS9_A.MP
  Bottom 0.152: v85.19,73.76 89.15,73.76 v89.92,73
N$69  (via drill 0.35)
  Top 0.152: v88.54,76.2 85.19,72.85 85.19,64.77 TEENSY4.1.37/A18
  Bottom 0.152: v88.54,76.2 94.03,76.2 95.25,74.98 LS7_A.MP
N$70  (via drill 0.35)
  Top 0.152: v82.14,27.43 82.14,14.17 84.28,12.04 v87.33,12.04
  Bottom 0.152: TEENSY4.1.36/A17 87.63,50.9 88.7,49.84 88.7,35.2 83.82,30.33 83.52,30.33 82.14,28.96 v82.14,27.43 | v87.33,12.04 87.33,5.33 88.85,3.81 LS8_A.MP
N$71  (via drill 0.35)
  Top 0.152: TEENSY4.1.35/A16 91.29,64.77 93.73,62.33 v97.23,62.33 | v97.54,12.5 v97.54,26.06
  Bottom 0.152: v97.23,62.33 97.23,61.87 97.54,61.57 v97.54,26.06 | v97.54,12.5 97.54,8.69 95.25,6.4 LS10_A.MP
(copper drawn outside any net)
  shapes: Top area x1